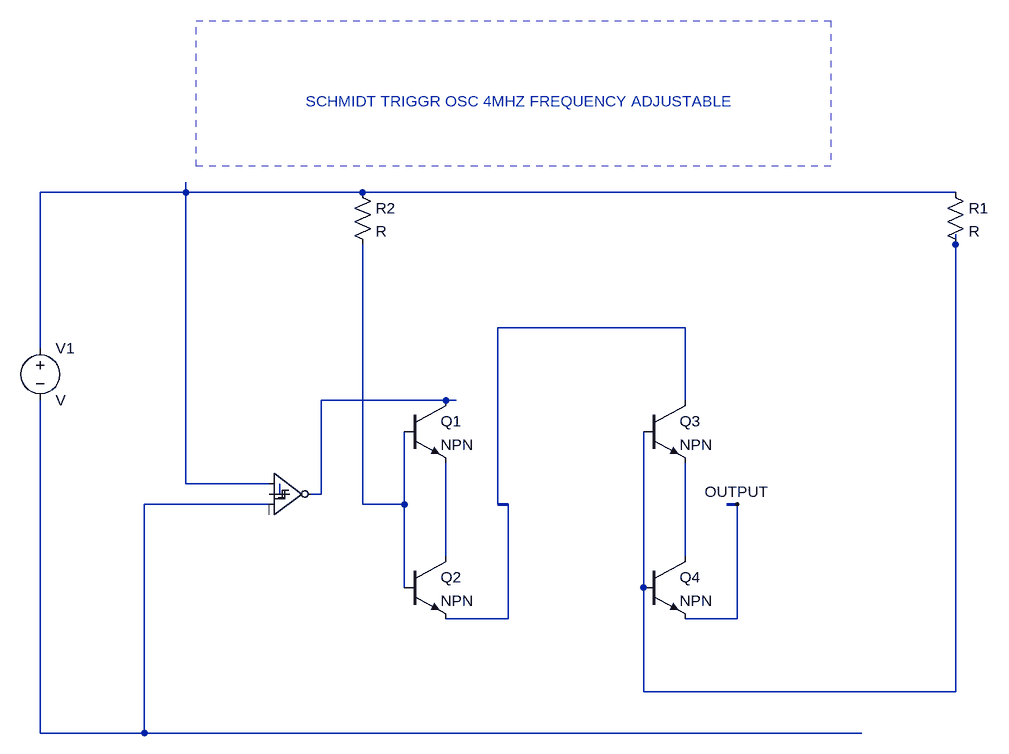
[diagram p0: schematic oscillatorModulatorQuartz.asc]
oscillatorModulatorQuartz.asc, the LTspice schematic file:
Version 4
SHEET 1 880 680
WIRE -560 -384 -560 -400
WIRE -560 -384 -784 -384
WIRE -288 -384 -560 -384
WIRE 624 -384 -288 -384
WIRE 624 -304 624 -320
WIRE 208 -176 -80 -176
WIRE -784 -144 -784 -384
WIRE -160 -64 -352 -64
WIRE -144 -64 -160 -64
WIRE 208 -64 208 -176
WIRE -560 64 -560 -384
WIRE -432 64 -560 64
WIRE -416 80 -416 64
WIRE -352 80 -352 -64
WIRE -352 80 -368 80
WIRE -432 96 -624 96
WIRE -288 96 -288 -304
WIRE -224 96 -224 -16
WIRE -224 96 -288 96
WIRE -80 96 -80 -176
WIRE -160 176 -160 32
WIRE 208 176 208 32
WIRE -224 224 -224 96
WIRE 144 224 144 -16
WIRE -64 272 -64 96
WIRE -64 272 -160 272
WIRE 288 272 288 96
WIRE 288 272 208 272
WIRE 144 384 144 224
WIRE 624 384 624 -304
WIRE 624 384 144 384
WIRE -784 448 -784 -64
WIRE -624 448 -624 96
WIRE -624 448 -784 448
WIRE 480 448 -624 448
FLAG 288 96 OUTPUT
FLAG -416 80 COM
DATAFLAG 480 448 "$"
BUSTAP -80 96 -64 96
BUSTAP 272 96 288 96
SYMBOL Digital/diffschmtinv -432 16 R0
WINDOW 0 144 151 Invisible 2
SYMATTR InstName s
SYMBOL npn -224 -64 R0
SYMATTR InstName Q1
SYMBOL npn -224 176 R0
SYMATTR InstName Q2
SYMBOL npn 144 -64 R0
SYMATTR InstName Q3
SYMBOL npn 144 176 R0
SYMATTR InstName Q4
SYMBOL voltage -784 -160 R0
SYMATTR InstName V1
SYMBOL res 608 -400 R0
SYMATTR InstName R1
SYMBOL res -304 -400 R0
SYMATTR InstName R2
TEXT -376 -524 Left 2 ;SCHMIDT TRIGGR OSC 4MHZ FREQUENCY ADJUSTABLE
RECTANGLE Normal -544 -648 432 -424 2

The netlist it stands for:
* oscillatorModulatorQuartz.asc
A§s N001 N005 0 0 0 N004 0 0 SCHMITT
Q1 N004 N006 N007 0 NPN
Q2 N007 N006 N009 0 NPN
Q3 N003 N002 N008 0 NPN
Q4 N008 N002 OUTPUT 0 NPN
V1 N001 N005 V
R1 N001 N002 R
R2 N001 N006 R
.model NPN NPN
.model PNP PNP
.lib standard.bjt
* SCHMIDT TRIGGR OSC 4MHZ FREQUENCY ADJUSTABLE
.backanno
.end